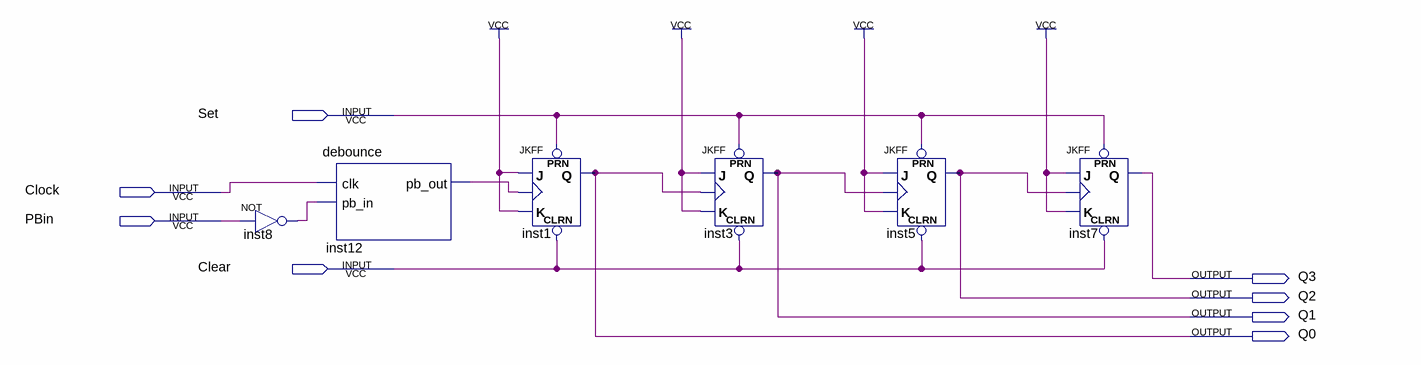
[diagram p0: schematic sheet]
// Quartus schematic counter2Debounced.bdf as structural Verilog: 6 symbols, 8 pins
module counter2Debounced (
  input  Set,
  input  Clock,
  input  PBin,
  input  Clear,
  output Q3,
  output Q2,
  output Q1,
  output Q0
);

  wire inst8_out, inst12_pb_out;

  not inst8 (inst8_out, PBin);
  debounce inst12 (.clk(Clock), .pb_in(inst8_out), .pb_out(inst12_pb_out));
  JKFF inst1 (.PRN(Set), .CLRN(Clear), .K(1'b1), .J(1'b1), .CLK(inst12_pb_out), .Q(Q0));
  JKFF inst3 (.PRN(Set), .CLRN(Clear), .K(1'b1), .J(1'b1), .CLK(Q0), .Q(Q1));
  JKFF inst5 (.PRN(Set), .CLRN(Clear), .K(1'b1), .J(1'b1), .CLK(Q1), .Q(Q2));
  JKFF inst7 (.PRN(Set), .CLRN(Clear), .K(1'b1), .J(1'b1), .CLK(Q2), .Q(Q3));
endmodule
